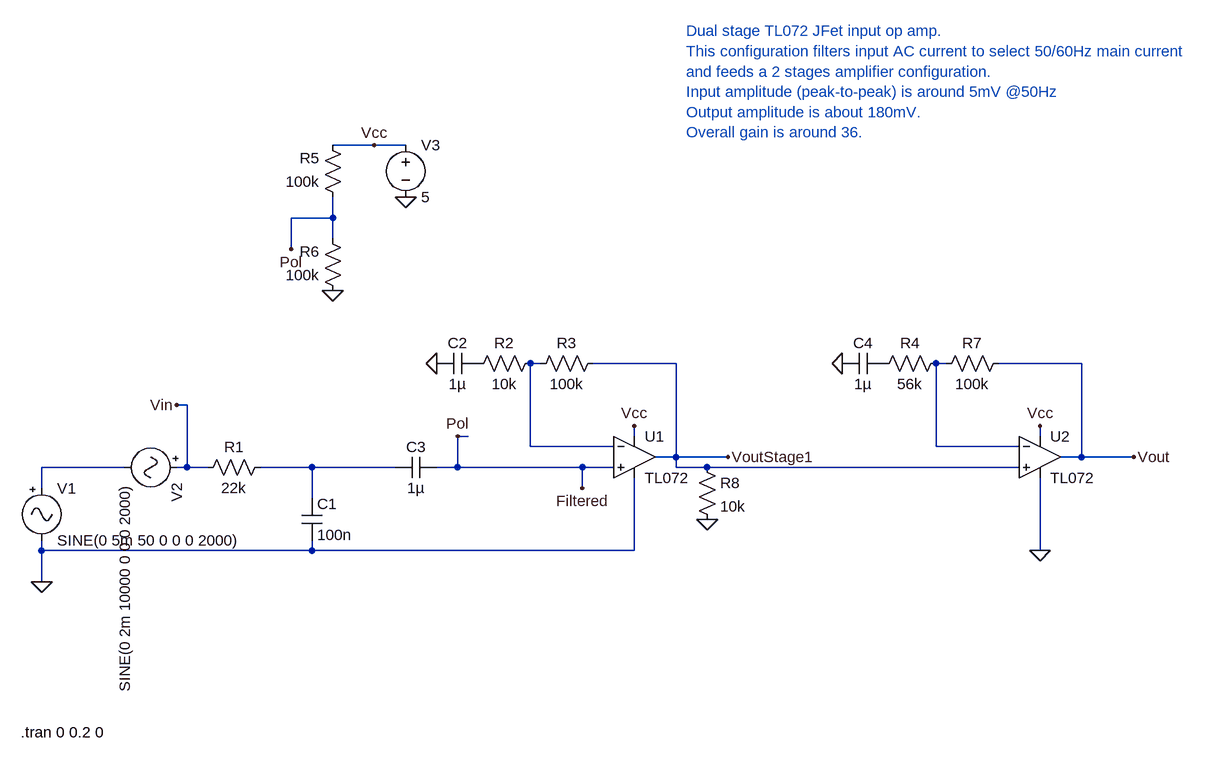
[diagram p0: schematic ACCurrentSensingAmp1.asc]
ACCurrentSensingAmp1.asc, the LTspice schematic file:
Version 4
SHEET 1 2504 680
WIRE 592 -384 528 -384
WIRE 640 -384 592 -384
WIRE 528 -272 528 -304
WIRE 528 -272 464 -272
WIRE 528 -240 528 -272
WIRE 464 -224 464 -272
WIRE 848 -48 832 -48
WIRE 1056 -48 928 -48
WIRE 1472 -48 1456 -48
WIRE 1680 -48 1552 -48
WIRE 304 16 288 16
WIRE 736 64 720 64
WIRE 992 64 992 48
WIRE 1616 64 1616 48
WIRE 832 80 832 -48
WIRE 960 80 832 80
WIRE 1456 80 1456 -48
WIRE 1584 80 1456 80
WIRE 1056 96 1056 -48
WIRE 1056 96 1024 96
WIRE 1136 96 1056 96
WIRE 1680 96 1680 -48
WIRE 1680 96 1648 96
WIRE 1760 96 1680 96
WIRE 208 112 80 112
WIRE 304 112 304 16
WIRE 304 112 288 112
WIRE 336 112 304 112
WIRE 496 112 416 112
WIRE 624 112 496 112
WIRE 720 112 720 64
WIRE 720 112 688 112
WIRE 912 112 720 112
WIRE 960 112 912 112
WIRE 1056 112 1056 96
WIRE 1104 112 1056 112
WIRE 1584 112 1104 112
WIRE 80 144 80 112
WIRE 912 144 912 112
WIRE 496 160 496 112
WIRE 80 240 80 224
WIRE 496 240 496 224
WIRE 496 240 80 240
WIRE 992 240 992 128
WIRE 992 240 496 240
WIRE 1616 240 1616 128
WIRE 80 288 80 240
FLAG 80 288 0
FLAG 640 -304 0
FLAG 1136 96 VoutStage1
FLAG 912 144 Filtered
FLAG 288 16 Vin
FLAG 528 -160 0
FLAG 464 -224 Pol
FLAG 688 -48 0
FLAG 720 64 Pol
FLAG 592 -384 Vcc
FLAG 992 48 Vcc
FLAG 1760 96 Vout
FLAG 1312 -48 0
FLAG 1616 48 Vcc
FLAG 1616 240 0
FLAG 1104 192 0
SYMBOL Misc\\signal 80 128 R0
WINDOW 123 0 0 Left 0
WINDOW 39 0 0 Left 0
SYMATTR InstName V1
SYMATTR Value SINE(0 5m 50 0 0 0 2000)
SYMBOL Misc\\signal 304 112 R90
WINDOW 123 0 0 Left 0
WINDOW 39 0 0 Left 0
SYMATTR InstName V2
SYMATTR Value SINE(0 2m 10000 0 0 0 2000)
SYMBOL res 432 96 R90
WINDOW 0 0 56 VBottom 2
WINDOW 3 32 56 VTop 2
SYMATTR InstName R1
SYMATTR Value 22k
SYMBOL cap 480 160 R0
SYMATTR InstName C1
SYMATTR Value 100n
SYMBOL res 848 -64 R90
WINDOW 0 0 56 VBottom 2
WINDOW 3 32 56 VTop 2
SYMATTR InstName R2
SYMATTR Value 10k
SYMBOL res 832 -32 R270
WINDOW 0 32 56 VTop 2
WINDOW 3 0 56 VBottom 2
SYMATTR InstName R3
SYMATTR Value 100k
SYMBOL voltage 640 -400 R0
WINDOW 123 0 0 Left 0
WINDOW 39 0 0 Left 0
SYMATTR InstName V3
SYMATTR Value 5
SYMBOL res 544 -288 R180
WINDOW 0 36 76 Left 2
WINDOW 3 36 40 Left 2
SYMATTR InstName R5
SYMATTR Value 100k
SYMBOL res 544 -144 R180
WINDOW 0 36 76 Left 2
WINDOW 3 36 40 Left 2
SYMATTR InstName R6
SYMATTR Value 100k
SYMBOL cap 752 -64 R90
WINDOW 0 0 32 VBottom 2
WINDOW 3 32 32 VTop 2
SYMATTR InstName C2
SYMATTR Value 1µ
SYMBOL cap 688 96 R90
WINDOW 0 0 32 VBottom 2
WINDOW 3 32 32 VTop 2
SYMATTR InstName C3
SYMATTR Value 1µ
SYMBOL OpAmps\\TL072 992 32 R0
SYMATTR InstName U1
SYMBOL res 1472 -64 R90
WINDOW 0 0 56 VBottom 2
WINDOW 3 32 56 VTop 2
SYMATTR InstName R4
SYMATTR Value 56k
SYMBOL res 1456 -32 R270
WINDOW 0 32 56 VTop 2
WINDOW 3 0 56 VBottom 2
SYMATTR InstName R7
SYMATTR Value 100k
SYMBOL cap 1376 -64 R90
WINDOW 0 0 32 VBottom 2
WINDOW 3 32 32 VTop 2
SYMATTR InstName C4
SYMATTR Value 1µ
SYMBOL OpAmps\\TL072 1616 32 R0
SYMATTR InstName U2
SYMBOL res 1088 96 R0
SYMATTR InstName R8
SYMATTR Value 10k
TEXT 48 520 Left 2 !.tran 0 0.2 0
TEXT 1072 -560 Left 2 ;Dual stage TL072 JFet input op amp.\nThis configuration filters input AC current to select 50/60Hz main current\nand feeds a 2 stages amplifier configuration.\nInput amplitude (peak-to-peak) is around 5mV @50Hz\nOutput amplitude is about 180mV. \nOverall gain is around 36.

The netlist it stands for:
* ACCurrentSensingAmp1.asc
V1 N003 0 SINE(0 5m 50 0 0 0 2000)
V2 Vin N003 SINE(0 2m 10000 0 0 0 2000)
R1 N004 Vin 22k
C1 N004 0 100n
R2 N001 P001 10k
R3 N001 VoutStage1 100k
V3 Vcc 0 5
R5 Pol Vcc 100k
R6 0 Pol 100k
C2 P001 0 1µ
C3 Pol N004 1µ
XU1 Pol N001 Vcc 0 VoutStage1 TL072  ; pins In+ In- V+ V- OUT
R4 N002 P002 56k
R7 N002 Vout 100k
C4 P002 0 1µ
XU2 VoutStage1 N002 Vcc 0 Vout TL072  ; pins In+ In- V+ V- OUT
R8 VoutStage1 0 10k
.tran 0 0.2 0
* Dual stage TL072 JFet input op amp.
* This configuration filters input AC current to select 50/60Hz main current
* and feeds a 2 stages amplifier configuration.
* Input amplitude (peak-to-peak) is around 5mV @50Hz
* Output amplitude is about 180mV.
* Overall gain is around 36.
.backanno
.end